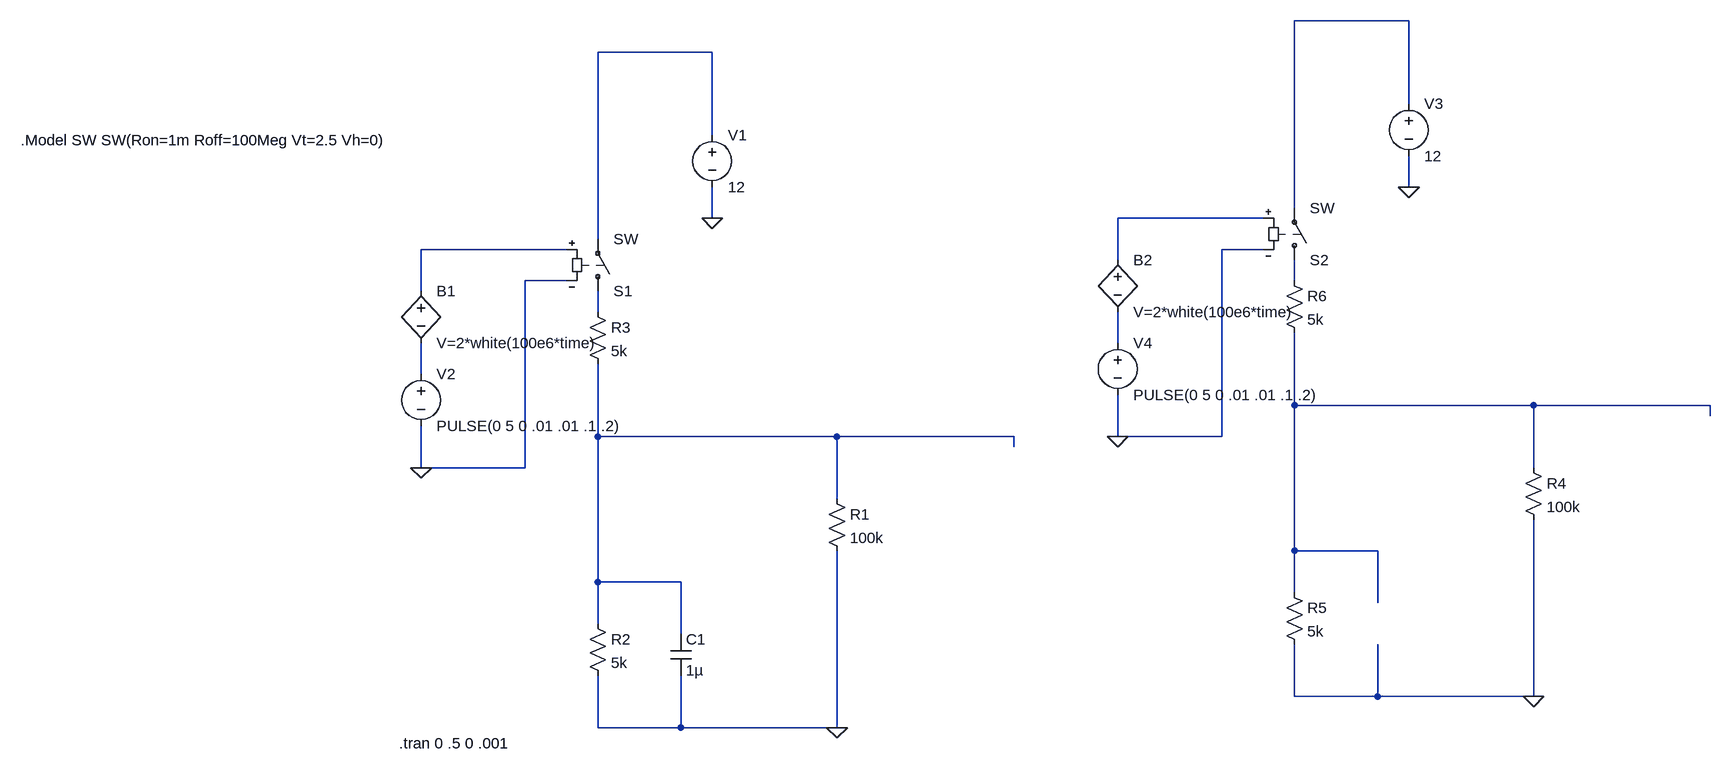
[diagram p0: schematic Button Debounce.asc]
Button Debounce.asc, the LTspice schematic file:
Version 4
SHEET 1 1636 680
WIRE 1168 -640 992 -640
WIRE 96 -592 -80 -592
WIRE 1168 -512 1168 -640
WIRE 96 -464 96 -592
WIRE 1168 -384 1168 -432
WIRE 992 -352 992 -640
WIRE 96 -336 96 -384
WIRE 944 -336 720 -336
WIRE -80 -304 -80 -592
WIRE -128 -288 -352 -288
WIRE 944 -288 880 -288
WIRE 720 -272 720 -336
WIRE -128 -240 -192 -240
WIRE 992 -240 992 -272
WIRE -352 -224 -352 -288
WIRE -80 -192 -80 -224
WIRE 720 -144 720 -192
WIRE -352 -96 -352 -144
WIRE 992 -48 992 -160
WIRE 1360 -48 992 -48
WIRE 1632 -48 1360 -48
WIRE 1632 -32 1632 -48
WIRE -80 0 -80 -112
WIRE 288 0 -80 0
WIRE 560 0 288 0
WIRE 720 0 720 -64
WIRE 880 0 880 -288
WIRE 880 0 720 0
WIRE 560 16 560 0
WIRE -352 48 -352 -16
WIRE -192 48 -192 -240
WIRE -192 48 -352 48
WIRE 1360 48 1360 -48
WIRE 288 96 288 0
WIRE 992 176 992 -48
WIRE 1120 176 992 176
WIRE -80 224 -80 0
WIRE 48 224 -80 224
WIRE 992 240 992 176
WIRE 1120 256 1120 176
WIRE -80 288 -80 224
WIRE 48 304 48 224
WIRE 992 400 992 320
WIRE 1120 400 1120 320
WIRE 1120 400 992 400
WIRE 1360 400 1360 128
WIRE 1360 400 1120 400
WIRE -80 448 -80 368
WIRE 48 448 48 368
WIRE 48 448 -80 448
WIRE 288 448 288 176
WIRE 288 448 48 448
FLAG 288 448 0
FLAG 96 -336 0
FLAG -352 48 0
FLAG 1360 400 0
FLAG 1168 -384 0
FLAG 720 0 0
SYMBOL res 272 80 R0
SYMATTR InstName R1
SYMATTR Value 100k
SYMBOL res -96 272 R0
SYMATTR InstName R2
SYMATTR Value 5k
SYMBOL res -96 -208 R0
SYMATTR InstName R3
SYMATTR Value 5k
SYMBOL cap 32 304 R0
SYMATTR InstName C1
SYMATTR Value 1µ
SYMBOL sw -80 -208 M180
SYMATTR InstName S1
SYMBOL voltage 96 -480 R0
WINDOW 123 0 0 Left 0
WINDOW 39 0 0 Left 0
SYMATTR InstName V1
SYMATTR Value 12
SYMBOL voltage -352 -112 R0
WINDOW 123 0 0 Left 0
WINDOW 39 0 0 Left 0
SYMATTR InstName V2
SYMATTR Value PULSE(0 5 0 .01 .01 .1 .2)
SYMBOL res 1344 32 R0
SYMATTR InstName R4
SYMATTR Value 100k
SYMBOL res 976 224 R0
SYMATTR InstName R5
SYMATTR Value 5k
SYMBOL res 976 -256 R0
SYMATTR InstName R6
SYMATTR Value 5k
SYMBOL sw 992 -256 M180
SYMATTR InstName S2
SYMBOL voltage 1168 -528 R0
WINDOW 123 0 0 Left 0
WINDOW 39 0 0 Left 0
SYMATTR InstName V3
SYMATTR Value 12
SYMBOL voltage 720 -160 R0
WINDOW 123 0 0 Left 0
WINDOW 39 0 0 Left 0
SYMATTR InstName V4
SYMATTR Value PULSE(0 5 0 .01 .01 .1 .2)
SYMBOL bv 720 -288 R0
SYMATTR InstName B2
SYMATTR Value V=2*white(100e6*time)
SYMBOL bv -352 -240 R0
SYMATTR InstName B1
SYMATTR Value V=2*white(100e6*time)
TEXT -386 472 Left 2 !.tran 0 .5 0 .001
TEXT -968 -456 Left 2 !.Model SW SW(Ron=1m Roff=100Meg Vt=2.5 Vh=0)

The netlist it stands for:
* Button Debounce.asc
R1 N010 0 100k
R2 N010 0 5k
R3 N006 N010 5k
C1 N010 0 1µ
S1 N006 N002 N004 0 SW
V1 N002 0 12
V2 N008 0 PULSE(0 5 0 .01 .01 .1 .2)
R4 N009 0 100k
R5 N009 0 5k
R6 N005 N009 5k
S2 N005 N001 N003 0 SW
V3 N001 0 12
V4 N007 0 PULSE(0 5 0 .01 .01 .1 .2)
B2 N003 N007 V=2*white(100e6*time)
B1 N004 N008 V=2*white(100e6*time)
.tran 0 .5 0 .001
.Model SW SW(Ron=1m Roff=100Meg Vt=2.5 Vh=0)
.backanno
.end